# Altium schematic sheet CPU_TDC.SchDoc: Title
size 420 x 297 mm; Author: G.Kasprowicz; CompanyName: WUT ISE; DrawnBy: G.Kasprowicz; Organization: WUT ISE; Address1: PW ISE; Address2: Nowowiejska 15/19 00-665 Warsaw; Address3: gkasprow@gmail.com; Revision: 2; SheetNumber: -; SheetTotal: -; ModifiedBy: -; CheckedDate: -; Title2: Title 2; DivGrp: WUT ISE; Designer: G.Kasprowicz; ModifiedDate: -; ProjectName: Sensor Box
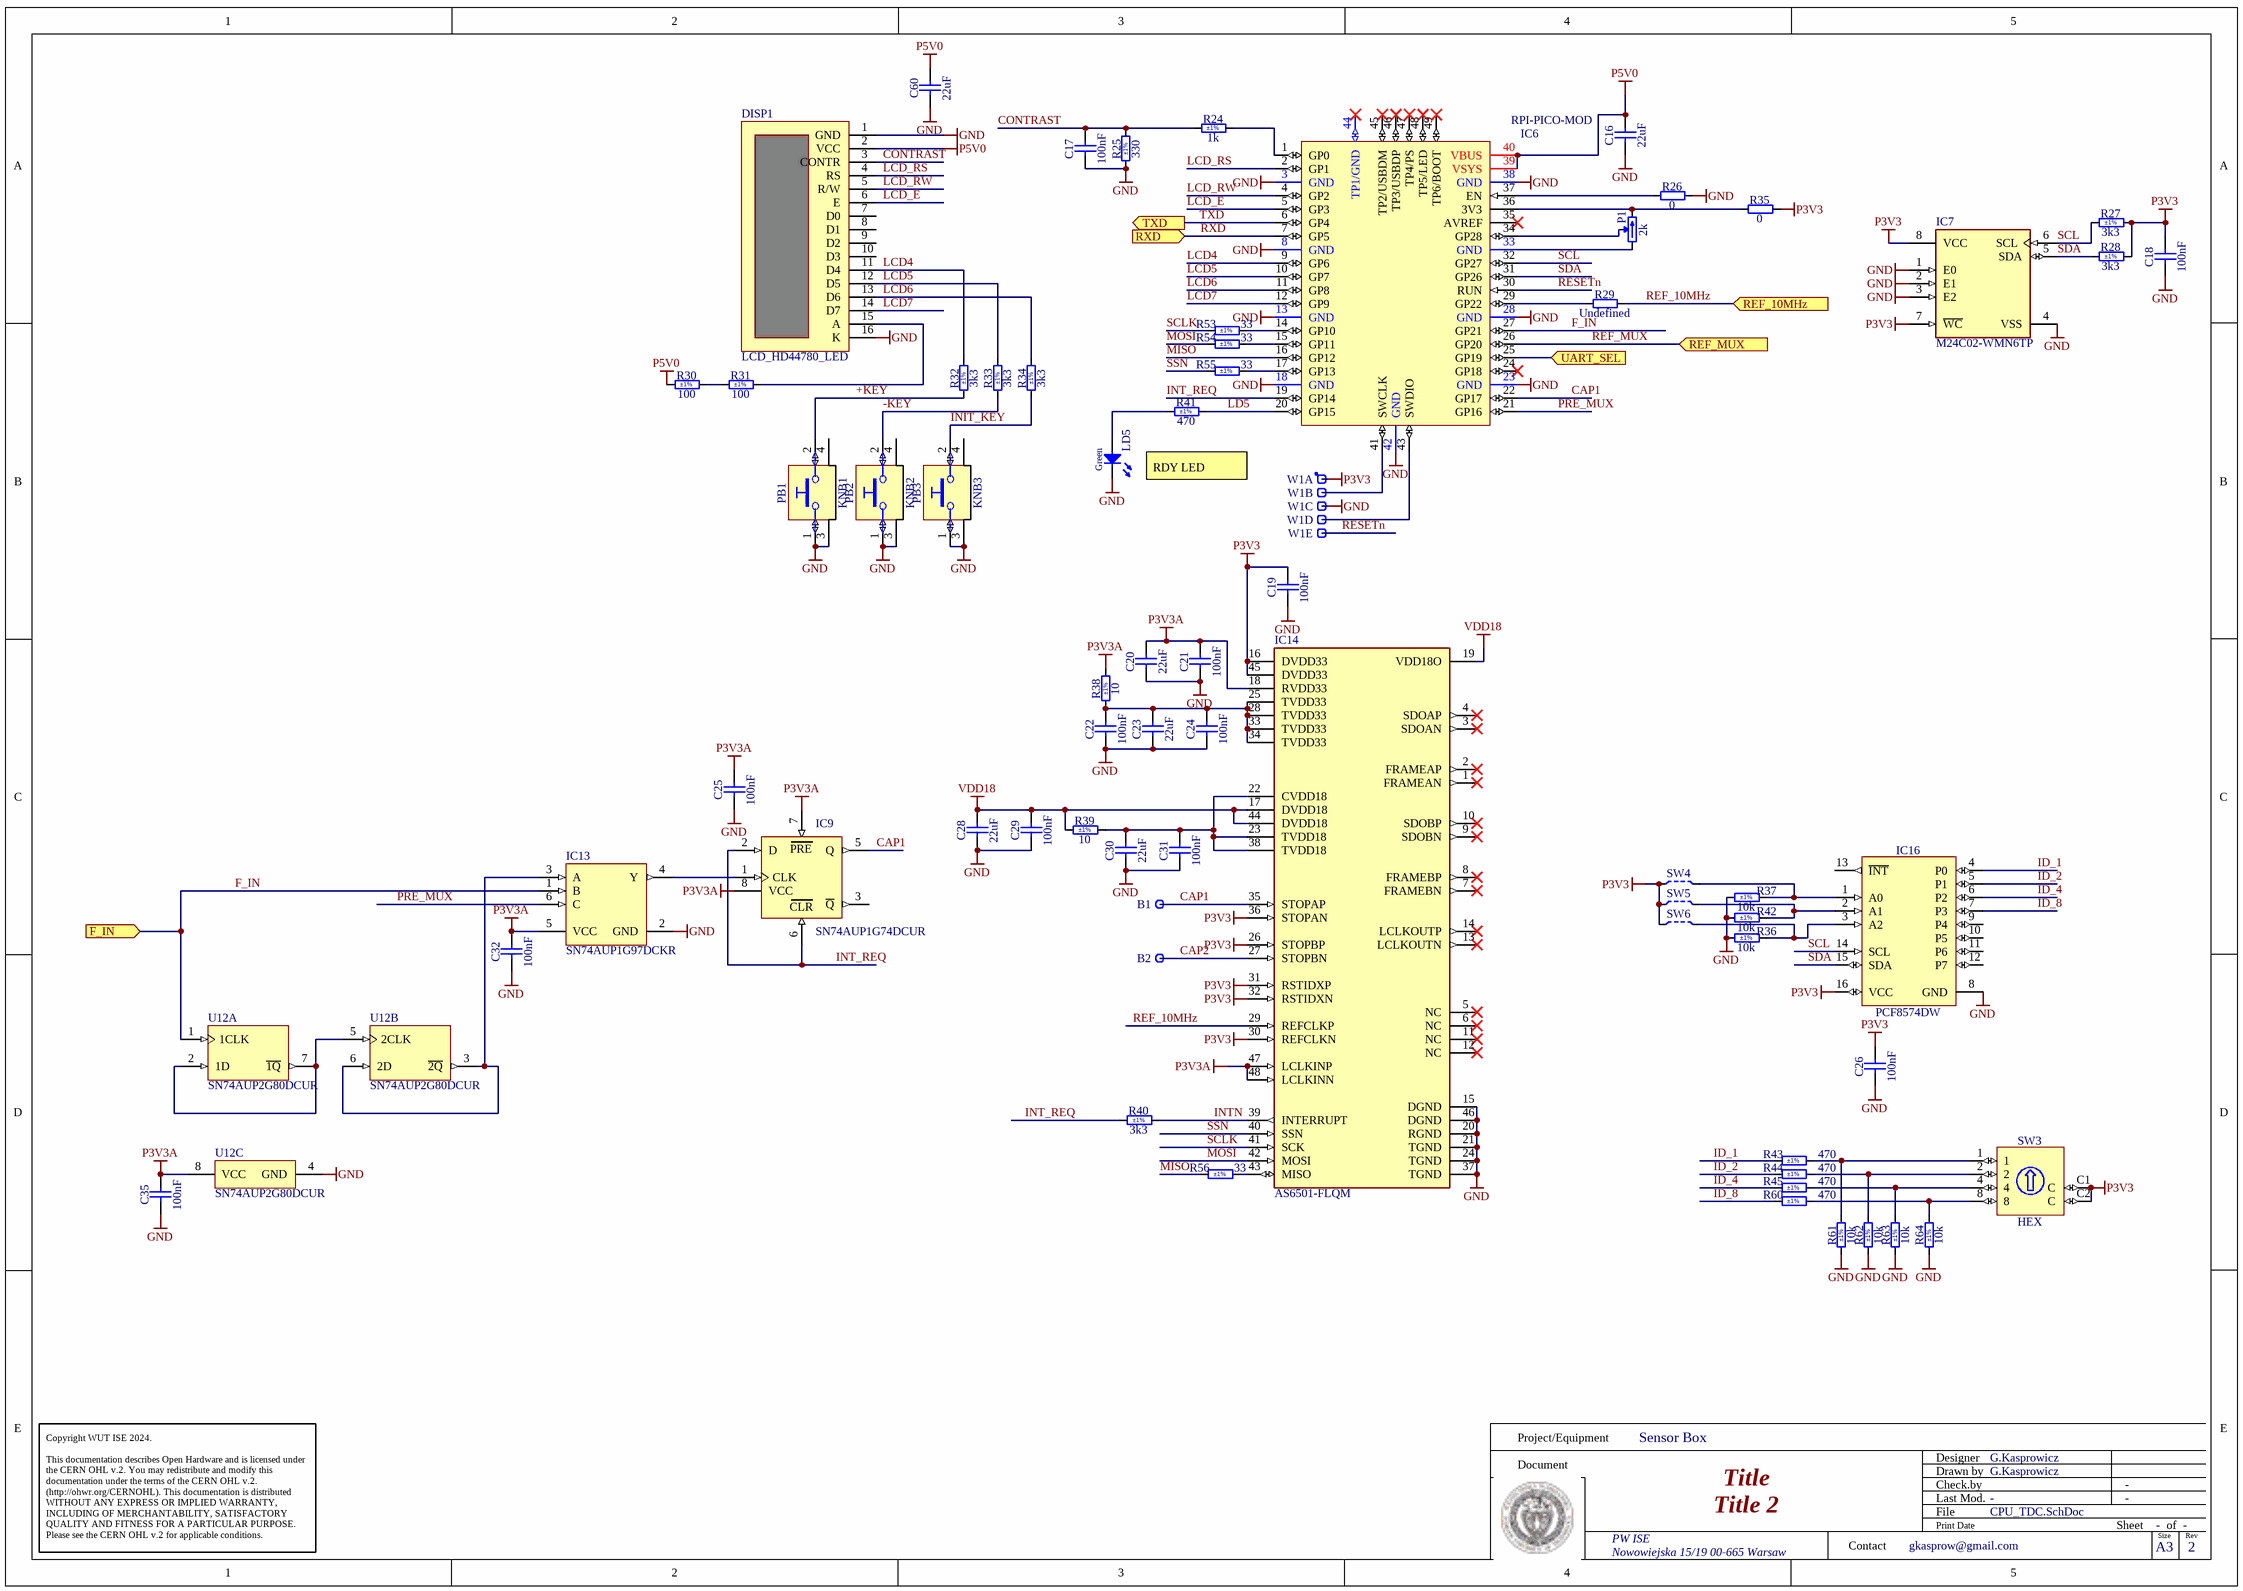
[diagram p0: CPU_TDC.SchDoc]

## Parts
B1  Plated Hole  [c150h50]  (value not drawn)  (no BOM)
B2  Plated Hole  [c150h50]  (value not drawn)  (no BOM)
C16  22uF  [CAPC3216X180N]
C17  100nF  [CAPC1608X90N]
C18  100nF  [CAPC1608X90N]
C19  100nF  [CAPC1608X90N]
C20  22uF  [CAPC3216X180N]
C21  100nF  [CAPC1608X90N]
C22  100nF  [CAPC1608X90N]
C23  22uF  [CAPC3216X180N]
C24  100nF  [CAPC1608X90N]
C25  100nF  [CAPC1608X90N]
C26  100nF  [CAPC2012X88N]
C28  22uF  [CAPC3216X180N]
C29  100nF  [CAPC1608X90N]
C30  22uF  [CAPC3216X180N]
C31  100nF  [CAPC1608X90N]
C32  100nF  [CAPC1608X90N]
C35  100nF  [CAPC1608X90N]
C60  22uF  [CAPC3216X180N]
DISP1  LCD_HD44780_LED  [IDC_16_male]
IC6  RPI-PICO-MOD  [RPI-PICO-MOD]
IC7  M24C02-WMN6TP  [FP-SO8N-SO-A-MFG]
IC9  SN74AUP1G74DCUR  [SOP50P310X90-8N]
IC13  SN74AUP1G97DCKR  [DCK0006A_M]
IC14  AS6501-FLQM  [FP-AS6501-FLQM-IPC_C]
IC16  PCF8574DW  [SOIC127P1030X265-16N]
KNB1  Knob  [KNB_OMRON_B32-2010_H]  (value not drawn)
KNB2  Knob  [KNB_OMRON_B32-2010_H]  (value not drawn)
KNB3  Knob  [KNB_OMRON_B32-2010_H]  (value not drawn)
LD5  Green  [LED_AVAGO_HSME-C110]
P1  2k  [TRIM_BOURNS_3296Z]
PB1  Push Button  [PB_OMRON_B3F-3150]  (value not drawn)
PB2  Push Button  [PB_OMRON_B3F-3150]  (value not drawn)
PB3  Push Button  [PB_OMRON_B3F-3150]  (value not drawn)
R24  1k  Tolerance: ±1%  [RESC1608X55N]
R25  330  Tolerance: ±1%  [RESC1608X55N]
R26  0  [RESC1608X55N]
R27  3k3  Tolerance: ±1%  [RESC1608X55N]
R28  3k3  Tolerance: ±1%  [RESC1608X55N]
R29  Undefined  [RESC1608X55N]
R30  100  Tolerance: ±1%  [RESC1608X55N]
R31  100  Tolerance: ±1%  [RESC1608X55N]
R32  3k3  Tolerance: ±1%  [RESC1608X55N]
R33  3k3  Tolerance: ±1%  [RESC1608X55N]
R34  3k3  Tolerance: ±1%  [RESC1608X55N]
R35  0  [RESC1608X55N]
R36  10k  Tolerance: ±1%  [RESC1608X55N]
R37  10k  Tolerance: ±1%  [RESC1608X55N]
R38  10  Tolerance: ±1%  [RESC1608X55N]
R39  10  Tolerance: ±1%  [RESC1608X55N]
R40  3k3  Tolerance: ±1%  [RESC1608X55N]
R41  470  Tolerance: ±1%  [RESC1608X55N]
R42  10k  Tolerance: ±1%  [RESC1608X55N]
R43  470  Tolerance: ±1%  [RESC1608X55N]
R44  470  Tolerance: ±1%  [RESC1608X55N]
R45  470  Tolerance: ±1%  [RESC1608X55N]
R53  33  Tolerance: ±1%  [RESC1608X55N]
R54  33  Tolerance: ±1%  [RESC1608X55N]
R55  33  Tolerance: ±1%  [RESC1608X55N]
R56  33  Tolerance: ±1%  [RESC1608X55N]
R60  470  Tolerance: ±1%  [RESC1608X55N]
R61  10k  Tolerance: ±1%  [RESC1608X55N]
R62  10k  Tolerance: ±1%  [RESC1608X55N]
R63  10k  Tolerance: ±1%  [RESC1608X55N]
R64  10k  Tolerance: ±1%  [RESC1608X55N]
SW3  HEX  [SW_APEM_PT65106L254]
SW4  Switch  [JUMPSMD0805_G50]  (value not drawn)  (no BOM)
SW5  Switch  [JUMPSMD0805_G50]  (value not drawn)  (no BOM)
SW6  Switch  [JUMPSMD0805_G50]  (value not drawn)  (no BOM)
U12  SN74AUP2G80DCUR  [DCU0008A_M]  (parts A,B,C of 3)
W1  Header 5  [SAMTEC_HTSW-105-23-L-S]  (value not drawn)  (parts A,B,C,D,E of 5)

## Ports
F_IN (in), REF_10MHz (in), REF_MUX (in), RXD (in), TXD (out), UART_SEL (in)

## Nets
GND: C16.1 C17.1 C18.1 C19.1 C20.1 C21.1 C22.1 C23.1 C24.1 C25.1 C26.1 C28.1 C29.1 C30.1 C31.1 C32.1 C35.1 C60.1 DISP1.1(GND) DISP1.16(K) IC6.3(GND) IC6.8(GND) IC6.13(GND) IC6.18(GND) IC6.23(GND) IC6.28(GND) IC6.38(GND) IC6.42(GND) IC7.1(E0) IC7.2(E1) IC7.3(E2) IC7.4(VSS) IC13.2(GND) IC14.15(DGND) IC14.20(RGND) IC14.21(TGND) IC14.24(TGND) IC14.37(TGND) IC14.46(DGND) IC16.8(GND) LD5.1(C) PB1.1 PB1.3 PB2.1 PB2.3 PB3.1 PB3.3 R25.1 R26.2 R36.1 R37.1 R42.1 R61.1 R62.1 R63.1 R64.1 U12.4(GND) W1.3
P3V3: C18.2 C19.2 C26.2 IC7.7(~{WC}) IC7.8(VCC) IC14.16(DVDD33) IC14.26(STOPBP) IC14.30(REFCLKN) IC14.31(RSTIDXP) IC14.32(RSTIDXN) IC14.36(STOPAN) IC14.45(DVDD33) IC16.16(VCC) R27.2 R28.2 R35.2 SW3.C1(C) SW3.C2(C) SW4.1 SW5.1 SW6.1 W1.1
P3V3A: C20.2 C21.2 C25.2 C32.2 C35.2 IC9.7(~{PRE}) IC9.8(VCC) IC13.5(VCC) IC14.18(RVDD33) IC14.47(LCLKINP) IC14.48(LCLKINN) R38.2 U12.8(VCC)
P5V0: C16.2 C60.2 DISP1.2(VCC) IC6.39(VSYS) IC6.40(VBUS) R30.1
VDD18: C28.2 C29.2 IC14.17(DVDD18) IC14.19(VDD18O) IC14.44(DVDD18) R39.1
+KEY: PB1.2 R32.1
-KEY: PB2.2 R33.1
CAP1: B1.1 IC6.22(GP17) IC9.5(Q) IC14.35(STOPAP)
CAP2: B2.1 IC14.27(STOPBN)
CONTRAST: C17.2 DISP1.3(CONTR) R24.1 R25.2
F_IN: IC6.27(GP21) IC13.1(B) U12.1(1CLK) ; port F_IN
ID_1: IC16.4(P0) R43.1
ID_2: IC16.5(P1) R44.1
ID_4: IC16.6(P2) R45.1
ID_8: IC16.7(P3) R60.1
INIT_KEY: PB3.2 R34.1
INT_REQ: IC6.19(GP14) IC9.2(D) IC9.6(~{CLR}) R40.1
INTN: IC14.39(INTERRUPT) R40.2
LCD4: DISP1.11(D4) IC6.9(GP6) R32.2
LCD5: DISP1.12(D5) IC6.10(GP7) R33.2
LCD6: DISP1.13(D6) IC6.11(GP8) R34.2
LCD7: DISP1.14(D7) IC6.12(GP9)
LCD_E: DISP1.6(E) IC6.5(GP3)
LCD_RS: DISP1.4(RS) IC6.2(GP1)
LCD_RW: DISP1.5(R/W) IC6.4(GP2)
LD5: IC6.20(GP15) R41.2
MISO: IC6.16(GP12) R56.1
MOSI: IC14.42(MOSI) R54.1
PRE_MUX: IC6.21(GP16) IC13.6(C)
REF_10MHz: IC14.29(REFCLKP) R29.2 ; port REF_10MHz
REF_MUX: IC6.26(GP20) ; port REF_MUX
RESETn: IC6.30(RUN) W1.5
RXD: IC6.7(GP5) ; port RXD
SCL: IC6.32(GP27) IC7.6(SCL) IC16.14(SCL) R27.1
SCLK: IC14.41(SCK) R53.1
SDA: IC6.31(GP26) IC7.5(SDA) IC16.15(SDA) R28.1
SSN: IC14.40(SSN) R55.1
TXD: IC6.6(GP4) ; port TXD
UART_SEL: IC6.25(GP19) ; port UART_SEL
NetC22_2: C22.2 C23.2 C24.2 IC14.25(TVDD33) IC14.28(TVDD33) IC14.33(TVDD33) IC14.34(TVDD33) R38.1
NetC30_2: C30.2 C31.2 IC14.22(CVDD18) IC14.23(TVDD18) IC14.38(TVDD18) R39.2
NetDISP1_15: DISP1.15(A) R31.2
NetIC6_1: IC6.1(GP0) R24.2
NetIC6_14: IC6.14(GP10) R53.2
NetIC6_15: IC6.15(GP11) R54.2
NetIC6_17: IC6.17(GP13) R55.2
NetIC6_29: IC6.29(GP22) R29.1
NetIC6_33: IC6.33(GND) P1.1(CCW)
NetIC6_34: IC6.34(GP28) P1.2(W)
NetIC6_36: IC6.36(3V3) P1.3(CW) R35.1
NetIC6_37: IC6.37(EN) R26.1
NetIC6_41: IC6.41(SWCLK) W1.2
NetIC6_43: IC6.43(SWDIO) W1.4
NetIC9_1: IC9.1(CLK) IC13.4(Y)
NetIC13_3: IC13.3(A) U12.3(~{2Q}) U12.6(2D)
NetIC14_43: IC14.43(MISO) R56.2
NetIC16_1: IC16.1(A0) R37.2 SW4.2
NetIC16_2: IC16.2(A1) R42.2 SW5.2
NetIC16_3: IC16.3(A2) R36.2 SW6.2
NetLD5_2: LD5.2(A) R41.1
NetR30_2: R30.2 R31.1
NetR43_2: R43.2 R61.2 SW3.1
NetR44_2: R44.2 R62.2 SW3.2
NetR45_2: R45.2 R63.2 SW3.4
NetR60_2: R60.2 R64.2 SW3.8
NetU12_2: U12.2(1D) U12.5(2CLK) U12.7(~{1Q})

Not connected (* = marked no-connect by the designer): DISP1 7(D0) 8(D1) 9(D2) 10(D3); IC6 24(GP18)* 35(AVREF)* 44(TP1/GND)* 45(TP2/USBDM)* 46(TP3/USBDP)* 47(TP4/PS)* 48(TP5/LED)* 49(TP6/BOOT)*; IC9 3(~{Q}) 4(GND); IC14 1(FRAMEAN)* 2(FRAMEAP)* 3(SDOAN)* 4(SDOAP)* 5(NC)* 6(NC)* 7(FRAMEBN)* 8(FRAMEBP)* 9(SDOBN)* 10(SDOBP)* 11(NC)* 12(NC)* 13(LCLKOUTN)* 14(LCLKOUTP)*; IC16 9(P4) 10(P5) 11(P6) 12(P7) 13(~{INT}); PB1 4; PB2 4; PB3 4

## Notes on the sheet
- RDY LED
- Project/Equipment
- Document
- Designer
- Drawn by
- Check.by
- Copyright WUT ISE 2024.
  This documentation describes Open Hardware and is licensed under the CERN OHL v.2. You may redistribute and modify this documentation under the terms of the CERN OHL v.2. (http://ohwr.org/CERNOHL). This documentation is distributed WITHOUT ANY EXPRESS OR IMPLIED WARRANTY, INCLUDING OF MERCHANTABILITY, SATISFACTORY QUALITY AND FITNESS FOR A PARTICULAR PURPOSE. Please see the CERN OHL v.2 for applicable conditions.
- Contact
- File
- Last Mod.
- Print Date
- Sheet
- Size
- A3
- of
- Rev
- (in symbol SN74AUP1G74DCUR) PRE; CLR

## Library data of the parts
B1 B2 = PLATED_HOLE0.5_PAD1.5: Single Terminal Socket; Part Description: Plated Through Hole: Hole Dia.=0.5mm Pad Dia.=1.5mm; Mounted: No; Part Number: PLATED_HOLE0.5_PAD1.5; Component Type: Standard (No BOM); Pin Count: 1; Family: Plated Hole; Socket: No; SMD: No; Sense: No; Status: None; ComponentHeight: 0mm; HelpURL: Undefined; Author: CERN DEM MR; CreateDate: 12.10.2017; LatestRevisionDate: 12.10.2017; PackageDescription: Plated Through Hole: Hole Dia.=0.5mm Pad Dia.=1.5mm
C16 C20 C23 C28 C30 C60 = CC1206_22UF_10V_10%_X7R: Non-polarised capacitor; Part Description: SMD Multilayer Chip Ceramic Capacitor; Manufacturer: GENERIC; Manufacturer1 Part Number: GRM31CR71A226KE15L; Voltage: 10V; TC: X7R; Tolerance: ±10%; Part Number: CC1206_22UF_10V_10%_X7R; Component Kind: Standard; Component Type: Standard; Pin Count: 2; Value: 22uF; Status: Preferred; Manufacturer Part Number: CC1206_22UF_10V_10%_X7R; Case: 1206; Mounted: Yes; Socket: No; SMD: Yes; Sense: No; Manufacturer1 Example: MURATA; Manufacturer1 ComponentHeight: 1.8mm; HelpURL: \\cern.ch\dfs\Applications\Altium\Datasheets\CC1206_X7R_MURATA_GRM-HI-CAP.pdf; Author: CERN DEM JLC; CreateDate: 08.06.2010; LatestRevisionDate: 08.06.2010
C17-C19 C21 C22 C24 C25 C29 C31 C32 C35 = CC0603_100NF_100V_10%_X7R: Non-polarised capacitor; Part Description: SMD Multilayer Chip Ceramic Capacitor; Manufacturer: GENERIC; Manufacturer1 Part Number: GRM188R72A104KA35D; Voltage: 100V; TC: X7R; Tolerance: ±10%; Part Number: CC0603_100NF_100V_10%_X7R; Component Kind: Standard; Component Type: Standard; Pin Count: 2; Value: 100nF; Status: None; Manufacturer Part Number: CC0603_100NF_100V_10%_X7R; Case: 0603; Mounted: Yes; Socket: No; SMD: Yes; Sense: No; Manufacturer1 Example: MURATA; Manufacturer1 ComponentHeight: 0.9mm; HelpURL: \\cern.ch\dfs\Applications\Altium\Datasheets\CC0603_MURATA_GRM188R72A104KA35D.pdf; Author: CERN DEM JLC; CreateDate: 11.12.2013; LatestRevisionDate: 11.12.2013
C26 = CC0805_100NF_50V_1%_NP0: Non-polarised capacitor; Part Description: SMD Multilayer Chip Ceramic Capacitor; Manufacturer: GENERIC; Manufacturer1 Part Number: 0805N103F500C; Voltage: 50V; TC: C0G/NP0; Tolerance: ±1%; Part Number: CC0805_100NF_50V_1%_NP0; Component Kind: Standard; Component Type: Standard; Footprint: CAPC2012X135N; Pin Count: 2; Value: 100nF; Status: Not Recommended; Manufacturer Part Number: CC0805_100NF_50V_1%_NP0; Case: 0805; Mounted: Yes; Socket: No; SMD: Yes; Sense: No; ComponentHeight: 1.35mm; Manufacturer1 Example: WALSIN TECHNOLOGY CORPORATION; Manufacturer1 ComponentHeight: 1.35mm; HelpURL: \\cern.ch\dfs\Applications\Altium\Datasheets\CC0805_WALSIN_0805.pdf; Author: CERN DEM HF; CreateDate: 28.08.2023; LatestRevisionDate: 28.08.2023
DISP1 = LCD_HD44780_LED: LCD character display socket with backlight
IC6 = RPI-PICO-MOD: RASPBERRY PI PICO RP2040 BOARD; Manufacturer: Raspberry Pi Foundation; Manufacturer Part No: SC0915; Mounting Technology: SMT; Supplier: DigiKey; Supplier Part No: 2648-SC0915CT-ND; Supplier Link: https://www.digikey.com/en/products/detail/raspberry-pi/SC0915/13684020
IC7 = CMP-2000-05370-2: IC EEPROM 2K I2C 400KHZ 8SO; Manufacturer: STMicroelectronics; Min Supply Voltage: 2.5V; Standoff Height: 0.1mm; Nominal Supply Current: 0.5-1mA; Access Time: 900ns; Memory Size: 2Kbits; Max Supply Voltage: 5.5V; Digikey Description: IC EEPROM 2K I2C 400KHZ 8SO; Memory Type: EEPROM; ComponentLink2URL: https://www.st.com/resource/en/datasheet/m24c02-w.pdf; Device Class L3: EEPROM; Interface: I2C; Temperature Range High: +85°C; Mouser Description: M24C02 Series 2 Kb (256 x 8) 2.5 V SMT Serial I²C Bus EEPROM - SOIC-8; RoHS: TRUE; Lead Free: Yes; Ambient Temperature Range Low: -40°C; Temperature: -40°C to +85°C; Device Class L1: Integrated Circuits (ICs); Temperature Range Low: -40°C; Frequency: 400kHz; Category: IC; Manufacturer Part Number: M24C02-WMN6TP; Height: 1.75mm; Octopart: https://octopart.com/m24c02-wmn6tp-stmicroelectronics-55404516; Automotive: No; Ambient Temperature Range High: +85°C; ComponentLink2Description: Datasheet; Package: SO8N-SO-A; Device Class L2: Memory
IC9 = SN74AUP1G74DCUR: Low-Power Single Positive-Edge-Triggered D-Type Flip-Flop with Clear and Preset; Manufacturer: TEXAS INSTRUMENTS; PressFit: No; Bonding: No; Part Number: SN74AUP1G74DCUR; Component Kind: Standard; Component Type: Standard; Device: SN74AUP1G74DCUR; PackageDescription: SOP, 0.50mm pitch; 8 pin, 2.30mm W X 2.00mm L X 0.90mm H body, IPC Medium Density; Part Description: Low-Power Single Positive-Edge-Triggered D-Type Flip-Flop with Clear and Preset; Manufacturer Part Number: SN74AUP1G74DCUR; Pin Count: 8; Case: TSSOP8; Mounted: Yes; Socket: No; SMD: Yes; Sense: No; ComponentHeight: 0.9mm; Author: CERN DEM JLC; HelpURL: \\cern.ch\dfs\Applications\Altium\Datasheets\SN74AUP1G74DCUR.pdf; CreateDate: 07.01.2015; LatestRevisionDate: 07.01.2015
IC13 = CMP-0859-00523-3: Low-Power Configurable Multiple-Function Gate, DCK0006A, LARGE T&R; Manufacturer: Texas Instruments; VCC(Min)(V): 0.8; Logic: True; Output Drive (IOL/IOH)(Max)(mA): 20/-20; 3-State Output: No; Voltage(Nom)(V): 0.8,1.2,1.5,1.8,2.5,3.3; Output Type: CMOS; Rating: Catalog; Technology Family: AUP; VCC(Max)(V): 3.6; Sub-Family: Configurable Logic; Bits(#): 1; ICC @ Nom Voltage(Max)(mA): 0.0009; tpd @ Nom Voltage(Max)(ns): 36.7,21.4,14.8,11.8,8.8,7.3; F @ Nom Voltage(Max)(Mhz): 100; DatasheetVersion: SCES505J; Gate Type: Configurable; Operating Temperature Range(C): -40 to 85; Generic Part Number: SN74AUP1G97; PackageReference: DCK0006A; Schmitt Trigger: No; Input Type: CMOS
IC14 = CMP-22772-000002-1: AS6501-FLQM LQFP48 LF T&RDP; Manufacturer: ams; Sensor Input: LVDS,Other; Max Junction Temp: +125°C; Min Supply Voltage: 2.4V; Standoff Height: 0.005mm; Interface: SPI,LVDS; Max Supply Voltage: 3.6V; Sensor Output: LVDS; Nominal Supply Current: 60uA; Ambient Temperature Range Low: -40°C; Temperature Range Low: -40°C; Ambient Temperature Range High: +125°C; Manufacturer Part Number: AS6501-FLQM; Height: 1.6mm; ComponentLink2URL: https://ams.com/documents/20143/36005/AS6501_DS000586_1-00.pdf; Package: 0; RoHS: TRUE; Digikey Description: AS6501-FLQM LQFP48 LF T&RDP; Ipc Land Pattern Name: QFP50P900X900X160-48; Automotive: No; Device Class L3: Sensor and Detector Interfaces; Temperature Range High: +125°C; Category: IC; Lead Free: Yes; Octopart: https://octopart.com/as6501-flqm-ams-96297058; Device Class L1: Integrated Circuits (ICs); Temperature: -40°C to +125°C; Device Class L2: Interface ICs; ComponentLink2Description: Datasheet
IC16 = PCF8574DW: Remote 8-bit I/O Expander For I2C Bus; Manufacturer: TEXAS INSTRUMENTS; PressFit: No; Bonding: No; Part Number: PCF8574DW; Component Kind: Standard; Component Type: Standard; Device: PCF8574DW; PackageDescription: SOIC, 1.27mm Pitch; 16 Pin, 7.50mm W X 10.3mm L X 2.65mm H body, IPC Medium Density; Part Description: Remote 8-bit I/O Expander for I2C Bus; Manufacturer Part Number: PCF8574DW; Pin Count: 16; Case: SOIC16W; Mounted: Yes; Socket: No; SMD: Yes; Sense: No; ComponentHeight: 2.65mm; Author: CERN DEM JLC; HelpURL: \\cern.ch\dfs\Applications\Altium\Datasheets\PCF8574DW.pdf; CreateDate: 25.08.2011; LatestRevisionDate: 25.08.2011
KNB1-KNB3 = KNB_OMRON_B32-2010_h: Knob For Push-Button Switch OMRON SERIE B32; Part Description: Black Knob For OMRON Push-Button Switch (Dia. 6mm L=5.5mm); PressFit: No; Part Number: KNB_OMRON_B32-2010_h; Component Kind: Accessories; Component Type: Mechanical; Pin Count: 0; PackageDescription: Black Knob For OMRON Push-Button Switch (Dia. 6mm L=5.5mm) Horizontal; Family: Knob; Mounted: Yes; Socket: No; SMD: No; Sense: No; Status: None; Manufacturer: OMRON; Manufacturer Part Number: B32-2010; ComponentHeight: 7mm; HelpURL: \\cern.ch\dfs\Applications\Altium\Datasheets\KNB_OMRON_B32-2010.pdf; Author: CERN DEM HF; CreateDate: 13.05.2022; LatestRevisionDate: 13.05.2022
LD5 = LED_AVAGO_HSME-C110: LED Green 1C 2A; Part Description: High Performance Right Angle Chip Green LED; Manufacturer: AVAGO TECHNOLOGIES; PressFit: No; Bonding: No; Part Number: LED_AVAGO_HSME-C110; Component Kind: Standard; Component Type: Standard; Color: Green; PackageDescription: Green Chip LED, 2-Leads, Body 3.3x1.6mm, Side Emitting Package; Manufacturer Part Number: HSME-C110; Pin Count: 2; Case: 1206; Mounted: Yes; Socket: No; SMD: Yes; Sense: No; ComponentHeight: 1.1mm; HelpURL: \\cern.ch\dfs\Applications\Altium\Datasheets\LED_AVAGO_HSME-C110.pdf; ComponentLink1URL: \\cern.ch\dfs\Applications\Altium\Datasheets\LED_AVAGO_HSME-C110_DESIGN-GUIDE.pdf; ComponentLink1Description: Design Guide; Author: CERN DEM JMW; CreateDate: 30.07.2009; LatestRevisionDate: 20.06.2012
P1 = TRIM_25T_2K_BOURNS_3296Z-1-202LF: Trimming Potentiometer; Part Description: 25 Turn Trimming Potentiometer (Side Adjustment); Manufacturer: BOURNS; Power: 0.5W; TC: ±100ppm/°C; Tolerance: ±10%; PressFit: No; Part Number: TRIM_25T_2K_BOURNS_3296Z-1-202LF; Component Kind: Standard; Component Type: Standard; Pin Count: 3; Value: 2k; Manufacturer Part Number: 3296Z-1-202LF; Case: 3296Z; Mounted: Yes; Socket: No; SMD: No; Sense: No; ComponentHeight: 10.03mm; HelpURL: \\cern.ch\dfs\Applications\Altium\Datasheets\TRIM_BOURNS_3296Z.pdf; Author: CERN DEM JLC; CreateDate: 31.03.2014; LatestRevisionDate: 31.03.2014
PB1-PB3 = PB_OMRON_B3F-3150: Push-Button Switch SPST; Part Description: 24VDC 50mA SPST-NO Tactile Push-Button Switch, Side-operated (h=7.4mm); Manufacturer: OMRON; PressFit: No; Part Number: PB_OMRON_B3F-3150; Component Kind: Standard; Component Type: Standard; Pin Count: 4; PackageDescription: 7.3x6.25mm Model, Side-operated , Projected Plunger Type (without Ground Terminal) Pushbutton Switch, OMRON B3F Series; Family: Push Button; Mounted: Yes; Socket: No; SMD: No; Sense: No; Status: None; Manufacturer Part Number: B3F-3150; ComponentHeight: 7.4mm; HelpURL: \\cern.ch\dfs\Applications\Altium\Datasheets\PB_OMRON_B3F-3150.pdf; Author: CERN DEM HF; CreateDate: 13.05.2022; LatestRevisionDate: 13.05.2022
R24 = R0603_1K_1%_0.1W_100PPM: Resistor - 1%; Part Description: General Purpose Thick Film Chip Resistor; Manufacturer: GENERIC; Manufacturer1 Part Number: NRC06F1001TRF; Power: 0.1W; TC: ±100ppm/°C; PressFit: No; Part Number: R0603_1K_1%_0.1W_100PPM; Component Kind: Standard; Component Type: Standard; Pin Count: 2; Value: 1k; Status: Preferred; Manufacturer Part Number: R0603_1K_1%_0.1W_100PPM; Case: 0603; Mounted: Yes; Sense: No; Socket: No; SMD: Yes; Manufacturer1 Example: NIC COMPONENT; Manufacturer1 ComponentHeight: 0.55mm; HelpURL: \\cern.ch\dfs\Applications\Altium\Datasheets\R0603_NIC_NRC.pdf; Author: CERN DEM JLC; CreateDate: 03.12.2007; LatestRevisionDate: 13.03.2008
R25 = R0603_330R_1%_0.1W_100PPM: Resistor - 1%; Part Description: General Purpose Thick Film Chip Resistor; Manufacturer: GENERIC; Manufacturer1 Part Number: NRC06F3300TRF; Power: 0.1W; TC: ±100ppm/°C; PressFit: No; Part Number: R0603_330R_1%_0.1W_100PPM; Component Kind: Standard; Component Type: Standard; Pin Count: 2; Value: 330; Status: Preferred; Manufacturer Part Number: R0603_330R_1%_0.1W_100PPM; Case: 0603; Mounted: Yes; Sense: No; Socket: No; SMD: Yes; Manufacturer1 Example: NIC COMPONENT; Manufacturer1 ComponentHeight: 0.55mm; HelpURL: \\cern.ch\dfs\Applications\Altium\Datasheets\R0603_NIC_NRC.pdf; Author: CERN DEM JLC; CreateDate: 03.12.2007; LatestRevisionDate: 13.03.2008
R26 R35 = R0603_0R_JUMPER: Resistor; Part Description: 1A (0.05R Max DC Resistance) Zero Ohm Jumper; Manufacturer: GENERIC; Manufacturer1 Part Number: NRC06Z0; PressFit: No; Part Number: R0603_0R_JUMPER; Component Kind: Standard; Component Type: Standard; Pin Count: 2; Value: 0; Status: Preferred; Manufacturer Part Number: R0603_0R_JUMPER; Case: 0603; Mounted: Yes; Sense: No; Socket: No; SMD: Yes; Manufacturer1 Example: NIC COMPONENT; Manufacturer1 ComponentHeight: 0.55mm; HelpURL: \\cern.ch\dfs\Applications\Altium\Datasheets\R0603_NIC_NRC.pdf; Author: CERN DEM JLC; CreateDate: 03.12.2007; LatestRevisionDate: 13.03.2008
R27 R28 R32-R34 R40 = R0603_3K3_1%_0.1W_100PPM: Resistor - 1%; Part Description: General Purpose Thick Film Chip Resistor; Manufacturer: GENERIC; Manufacturer1 Part Number: NRC06F3301TRF; Power: 0.1W; TC: ±100ppm/°C; PressFit: No; Part Number: R0603_3K3_1%_0.1W_100PPM; Component Kind: Standard; Component Type: Standard; Pin Count: 2; Value: 3k3; Status: Preferred; Manufacturer Part Number: R0603_3K3_1%_0.1W_100PPM; Case: 0603; Mounted: Yes; Sense: No; Socket: No; SMD: Yes; Manufacturer1 Example: NIC COMPONENT; Manufacturer1 ComponentHeight: 0.55mm; HelpURL: \\cern.ch\dfs\Applications\Altium\Datasheets\R0603_NIC_NRC.pdf; Author: CERN DEM JLC; CreateDate: 03.12.2007; LatestRevisionDate: 13.03.2008
R29 = R0603_NO-VALUE: Resistor; Part Description: Reserved Footprint For a 0603 (1608) Chip Resistor; PressFit: No; Mounted: No; Part Number: R0603_NO-VALUE; Component Kind: Standard; Component Type: Standard; Pin Count: 2; Value: Undefined; Status: None; Manufacturer: Undefined; Manufacturer Part Number: R0603_NO-VALUE; Case: 0603; Sense: No; Socket: No; SMD: Yes; Manufacturer1 Example: Undefined; Manufacturer1 Part Number: Undefined; Manufacturer1 ComponentHeight: Undefined; HelpURL: Undefined; Author: CERN DEM JLC; CreateDate: 03.12.2007; LatestRevisionDate: 13.03.2008
R30 R31 = R0603_100R_1%_0.1W_100PPM: Resistor - 1%; Part Description: General Purpose Thick Film Chip Resistor; Manufacturer: GENERIC; Manufacturer1 Part Number: NRC06F4700TRF; Power: 0.1W; TC: ±100ppm/°C; PressFit: No; Part Number: R0603_100R_1%_0.1W_100PPM; Component Kind: Standard; Component Type: Standard; Pin Count: 2; Value: 100; Status: Preferred; Manufacturer Part Number: R0603_100R_1%_0.1W_100PPM; Case: 0603; Mounted: Yes; Sense: No; Socket: No; SMD: Yes; Manufacturer1 Example: NIC COMPONENT; Manufacturer1 ComponentHeight: 0.55mm; HelpURL: \\cern.ch\dfs\Applications\Altium\Datasheets\R0603_NIC_NRC.pdf; Author: CERN DEM JLC; CreateDate: 03.12.2007; LatestRevisionDate: 13.03.2008
R36 R37 R42 R61-R64 = R0603_10K_1%_0.1W_100PPM: Resistor - 1%; Part Description: General Purpose Thick Film Chip Resistor; Manufacturer: GENERIC; Manufacturer1 Part Number: NRC06F1002TRF; Power: 0.1W; TC: ±100ppm/°C; PressFit: No; Part Number: R0603_10K_1%_0.1W_100PPM; Component Kind: Standard; Component Type: Standard; Pin Count: 2; Value: 10k; Status: Preferred; Manufacturer Part Number: R0603_10K_1%_0.1W_100PPM; Case: 0603; Mounted: Yes; Sense: No; Socket: No; SMD: Yes; Manufacturer1 Example: NIC COMPONENT; Manufacturer1 ComponentHeight: 0.55mm; HelpURL: \\cern.ch\dfs\Applications\Altium\Datasheets\R0603_NIC_NRC.pdf; Author: CERN DEM JLC; CreateDate: 03.12.2007; LatestRevisionDate: 13.03.2008
R38 R39 = R0603_10R_1%_0.1W_100PPM: Resistor - 1%; Part Description: General Purpose Thick Film Chip Resistor; Manufacturer: GENERIC; Manufacturer1 Part Number: RMCF0603FT10R0; Power: 0.1W; TC: ±100ppm/°C; PressFit: No; Part Number: R0603_10R_1%_0.1W_100PPM; Component Kind: Standard; Component Type: Standard; Pin Count: 2; Value: 10; Status: Preferred; Manufacturer Part Number: R0603_10R_1%_0.1W_100PPM; Case: 0603; Mounted: Yes; Sense: No; Socket: No; SMD: Yes; Manufacturer1 Example: STACKPOLE ELECTRONICS; Manufacturer1 ComponentHeight: 0.6mm; HelpURL: \\cern.ch\dfs\Applications\Altium\Datasheets\R0603_STACKPOLE_RMCF.pdf; Author: CERN DEM HF; CreateDate: 06.02.2024; LatestRevisionDate: 06.02.2024
R41 R43-R45 R60 = R0603_470R_1%_0.1W_100PPM: Resistor - 1%; Part Description: General Purpose Thick Film Chip Resistor; Manufacturer: GENERIC; Manufacturer1 Part Number: NRC06F4700TRF; Power: 0.1W; TC: ±100ppm/°C; PressFit: No; Part Number: R0603_470R_1%_0.1W_100PPM; Component Kind: Standard; Component Type: Standard; Pin Count: 2; Value: 470; Status: Preferred; Manufacturer Part Number: R0603_470R_1%_0.1W_100PPM; Case: 0603; Mounted: Yes; Sense: No; Socket: No; SMD: Yes; Manufacturer1 Example: NIC COMPONENT; Manufacturer1 ComponentHeight: 0.55mm; HelpURL: \\cern.ch\dfs\Applications\Altium\Datasheets\R0603_NIC_NRC.pdf; Author: CERN DEM JLC; CreateDate: 03.12.2007; LatestRevisionDate: 13.03.2008
R53-R56 = R0603_33R_1%_0.1W_100PPM: Resistor - 1%; Part Description: General Purpose Thick Film Chip Resistor; Manufacturer: GENERIC; Manufacturer1 Part Number: NRC06F33R0TRF; Power: 0.1W; TC: ±100ppm/°C; PressFit: No; Part Number: R0603_33R_1%_0.1W_100PPM; Component Kind: Standard; Component Type: Standard; Pin Count: 2; Value: 33; Status: Preferred; Manufacturer Part Number: R0603_33R_1%_0.1W_100PPM; Case: 0603; Mounted: Yes; Sense: No; Socket: No; SMD: Yes; Manufacturer1 Example: NIC COMPONENT; Manufacturer1 ComponentHeight: 0.55mm; HelpURL: \\cern.ch\dfs\Applications\Altium\Datasheets\R0603_NIC_NRC.pdf; Author: CERN DEM JLC; CreateDate: 03.12.2007; LatestRevisionDate: 13.03.2008
SW3 = SW_APEM_PT65106L254: Rotary Code Switch 1 2 4 8 C1 C2; Part Description: Rotary Hexadecimal Right Angled Switch, Screwdriver Actuator, Straight terminals; Manufacturer: APEM; PressFit: No; Part Number: SW_APEM_PT65106L254; Component Kind: Standard; Component Type: Standard; Pin Count: 6; PackageDescription: Body 10x10mm, Right Angled Rotary Hexadecimal Code Switch With Screwdriver Actuator, APEM PT65 (CR65) Series; Family: HEX; Mounted: Yes; Socket: No; SMD: No; Sense: No; Status: None; Manufacturer Part Number: PT65106L254; ComponentHeight: 10mm; HelpURL: \\cern.ch\dfs\Applications\Altium\Datasheets\SW_APEM_PT65106L254.pdf; Author: CERN DEM JLC; CreateDate: 18.06.2014; LatestRevisionDate: 18.06.2014
SW4-SW6 = JUMPSMD0805_G50: 2 SMD Pads for Bound by Solder  Drop; Part Description: 2 SMD Pads for Bound by Solder Drop - Equivalent Size 0805 - Gap 0.5mm; Manufacturer: None; Mounted: No; PressFit: No; Part Number: JUMPSMD0805_G50; Component Type: Standard (No BOM); Pin Count: 2; PackageDescription: 2 SMD Pads for Bound by Solder Drop - Equivalent Size 0805 - Gap 0.5mm; Family: Switch; Socket: No; SMD: No; Sense: No; Status: None; Manufacturer Part Number: None; ComponentHeight: 0mm; HelpURL: None; Author: CERN DEM JLC; CreateDate: 26.08.2009; LatestRevisionDate: 12.02.2021
U12 = CMP-0859-00714-3: Low-Power Dual Positive-Edge-Triggered D-Type Flip-Flop, DCU0008A, LARGE T&R; Manufacturer: Texas Instruments; Schmitt Trigger: No; Technology Family: AUP; Bits(#): 2; Input Type: CMOS; tpd @ Nom Voltage(Max)(ns): 28.4,20.7,14.1,11.2,7.9,6.4; F @ Nom Voltage(Max)(Mhz): 100; VCC(Max)(V): 3.6; Voltage(Nom)(V): 0.8,1.2,1.5,1.8,2.5,3.3; Output Drive (IOL/IOH)(Max)(mA): 20/-20; Rating: Catalog; Logic: True; ICC @ Nom Voltage(Max)(mA): 0.0009; VCC(Min)(V): 0.8; Generic Part Number: SN74AUP2G80; Sub-Family: D-Type Flip-Flop; PackageReference: DCU0008A; 3-State Output: No; DatasheetVersion: SCES756A; Output Type: CMOS; Operating Temperature Range(C): -40 to 85
W1 = SAMTEC_HTSW-105-23-L-S: 5 Mini Wire-Wrap Contact Strip Header; Part Description: 5 Contacts, Pitch 2.54mm, Single Row  Through Mount Straight Header (Post Lead 5.84mm, Tail Lead 2.92mm, Insulator 2.54mm); Manufacturer: SAMTEC; PressFit: No; Status Comment: High Temperature; Part Number: SAMTEC_HTSW-105-23-L-S; Component Kind: Standard; Component Type: Standard; Pin Count: 5; Family: Header 5; Mounted: Yes; Socket: No; SMD: No; Sense: No; Status: Preferred; Manufacturer Part Number: HTSW-105-23-L-S; ComponentHeight: 8.38mm; HelpURL: \\cern.ch\dfs\Applications\Altium\Datasheets\SAMTEC_HTSW-105-23-L-S.pdf; Author: CERN DEM JLC; CreateDate: 22.02.2018; LatestRevisionDate: 22.02.2018